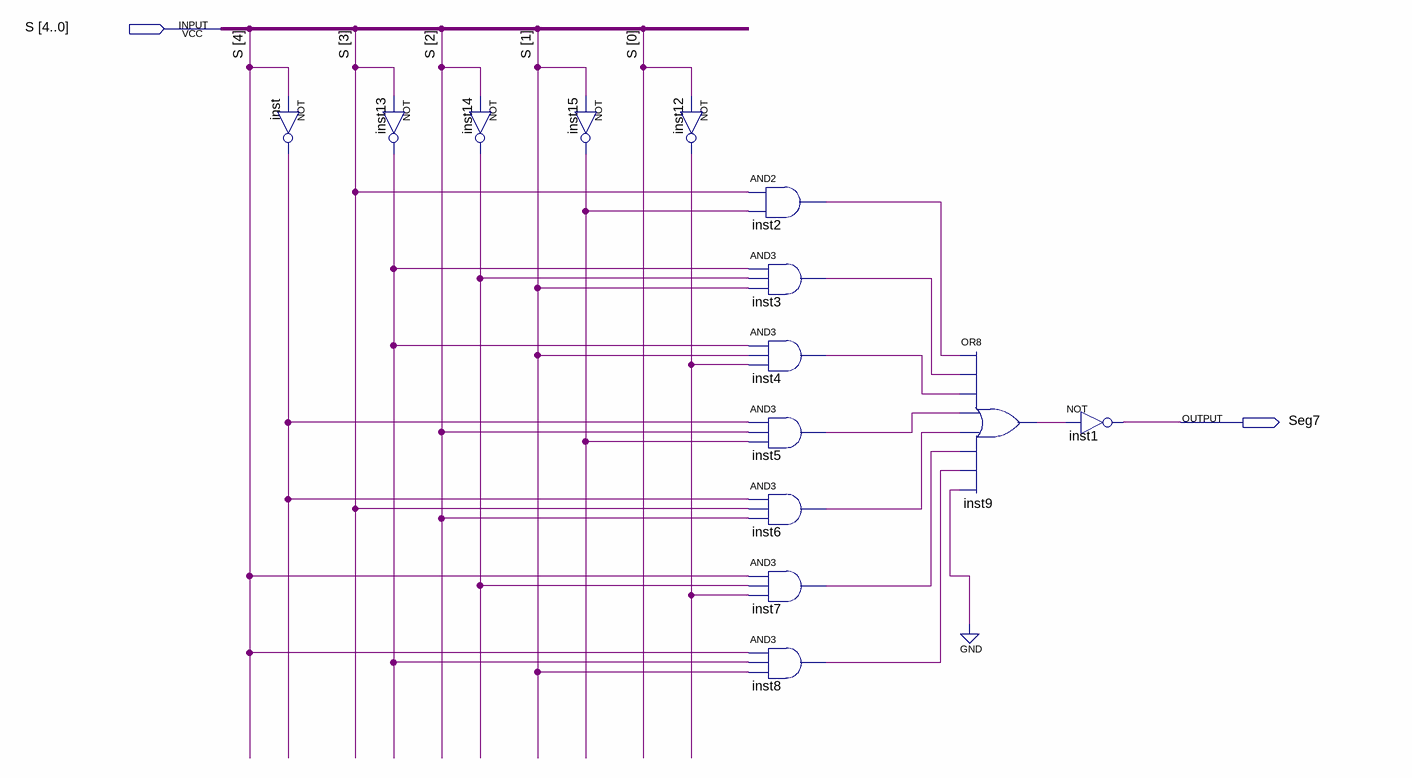
[diagram p0: schematic sheet]
// Quartus schematic Seg7.bdf as structural Verilog: 14 symbols, 2 pins
module Seg7 (
  input  [4:0] S,
  output Seg7
);

  wire inst2_out, inst3_out, inst4_out, inst5_out, inst6_out, inst7_out, inst8_out, inst9_out, inst12_out,
       inst13_out, inst14_out, inst15_out, inst_out;

  not inst (inst_out, S[4]);
  not inst13 (inst13_out, S[3]);
  not inst14 (inst14_out, S[2]);
  not inst15 (inst15_out, S[1]);
  not inst12 (inst12_out, S[0]);
  and inst2 (inst2_out, S[3], inst15_out);
  and inst3 (inst3_out, inst13_out, inst14_out, S[1]);
  and inst4 (inst4_out, inst13_out, S[1], inst12_out);
  and inst5 (inst5_out, inst_out, S[2], inst15_out);
  and inst6 (inst6_out, inst_out, S[3], S[2]);
  and inst7 (inst7_out, S[4], inst14_out, inst12_out);
  and inst8 (inst8_out, S[4], inst13_out, S[1]);
  or inst9 (inst9_out, inst2_out, inst3_out, inst4_out, inst5_out, inst6_out, inst7_out, inst8_out, 1'b0);
  not inst1 (Seg7, inst9_out);
endmodule
